# EAGLE design MTX_pic_piggyback_BRW_qfn_V14 (EAGLE 7.5.0)
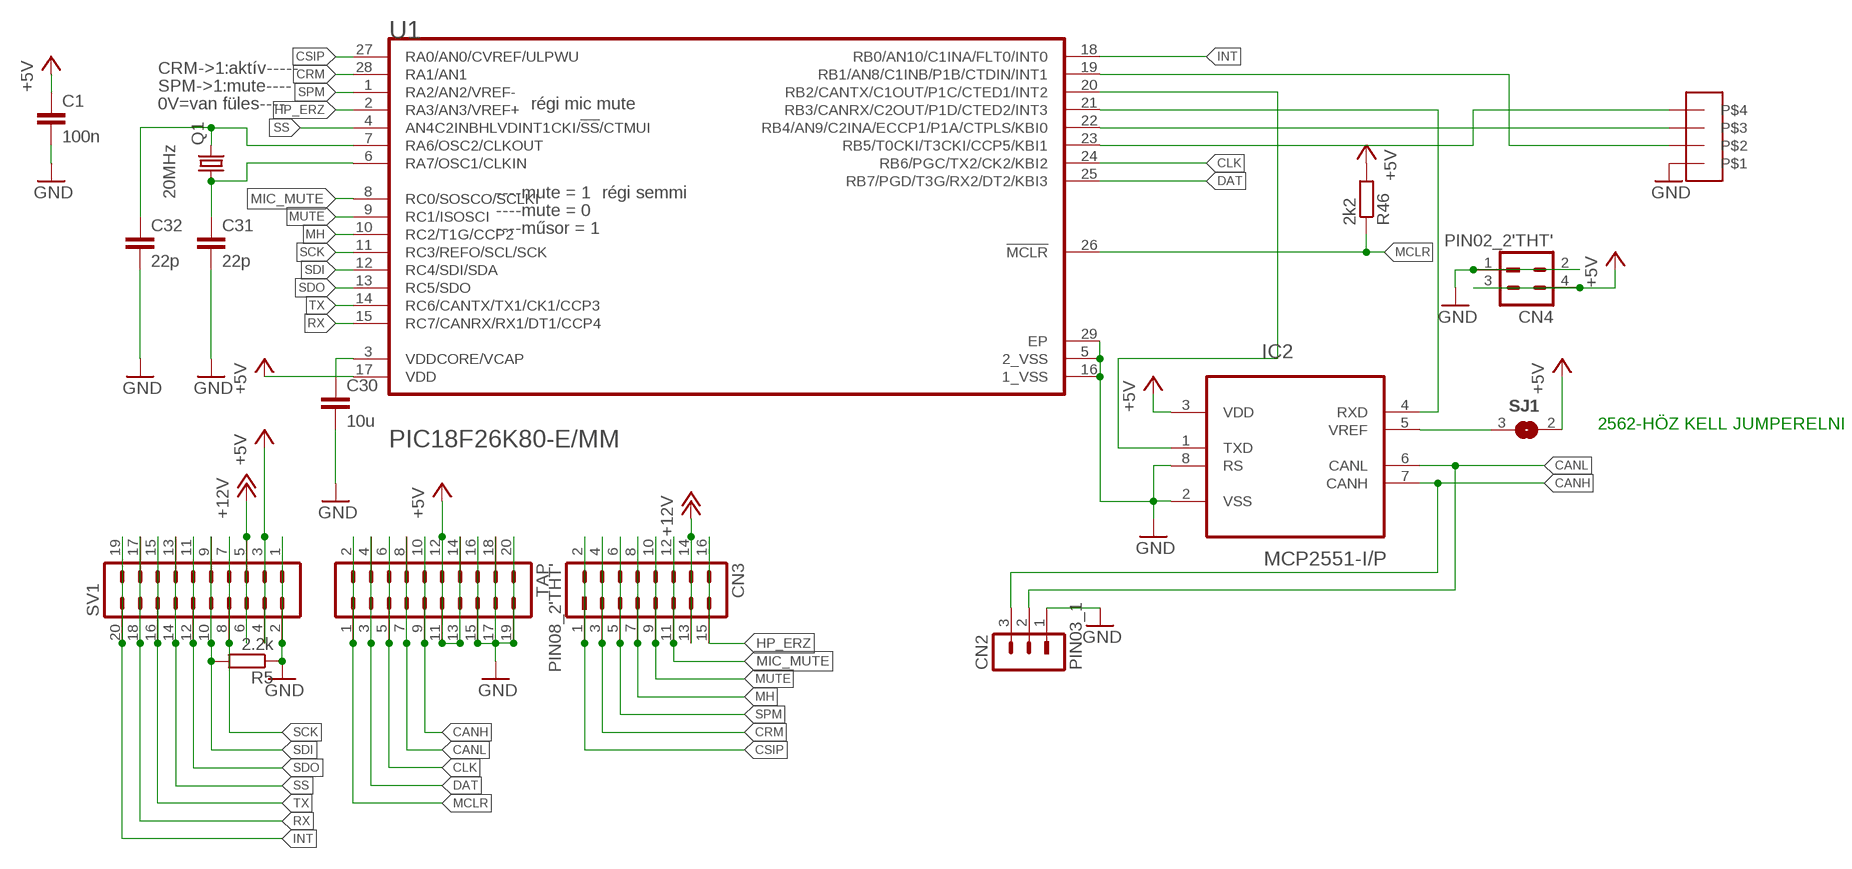
[diagram p0: schematic, sheet 1]

## Parts
C1  100n  C-EUC0805  [C0805]
C30  10u  C-EUC0805  [C0805]
C31  22p  C-EUC0805  [C0805]
C32  22p  C-EUC0805  [C0805]
CN2  PIN03_1  [PIN03_1]
CN3  PIN08_2'THT'  [PIN08_2]
CN4  PIN02_2'THT'  [PIN02_2]
IC2  MCP2551-I/P  [DIP254P762X432-8]
Q1  20MHz  XTAL_2QS  [XTAL_QS]
R5  2.2k  R-EU_R0805  [R0805]
R46  2k2  R-EU_R0805  [R0805]
SJ1  SJ  [SJ]
SV1  MA10-2  [MA10-2]
TAP  MA10-2  [MA10-2]
U1  MICROCHIP_PIC18F26K80-E-MMMICROCHIP_PIC18F26K80-E-MM_0_2  [MICROCHIP_PIC18F26K80-E-MM_2]
U$1  FEHER_TUS_4  [FEHER_TUS_4]

## Nets
+5V: C1.1 CN4.3 CN4.4 IC2.3(VDD) R46.2 SJ1.2 SV1.3 SV1.4 TAP.11 TAP.12 TAP.13 TAP.14 U1.17(VDD)
+12V: CN3.13 CN3.14 SV1.5 SV1.6
CANH: CN2.3 IC2.7(CANH) TAP.9 TAP.10
CANL: CN2.2 IC2.6(CANL) TAP.7 TAP.8
CLK: TAP.5 TAP.6 U1.24(RB6/PGC/TX2/CK2/KBI2)
CRM: CN3.3 CN3.4 U1.28(RA1/AN1)
CSIP: CN3.1 CN3.2 U1.27(RA0/AN0/CVREF/ULPWU)
DAT: TAP.3 TAP.4 U1.25(RB7/PGD/T3G/RX2/DT2/KBI3)
GND: C1.2 C30.2 C31.2 C32.2 CN2.1 CN4.1 CN4.2 IC2.2(VSS) IC2.8(RS) R5.1 SV1.1 SV1.2 TAP.15 TAP.16 TAP.17 TAP.18 TAP.19 TAP.20 U1.5(2_VSS) U1.16(1_VSS) U1.29(EP) U$1.P$1
HP_ERZ: CN3.15 CN3.16 U1.2(RA3/AN3/VREF+)
INT: SV1.19 SV1.20 U1.18(RB0/AN10/C1INA/FLT0/INT0)
MCLR: R46.1 TAP.1 TAP.2 U1.26(!MCLR!)
MH: CN3.7 CN3.8 U1.10(RC2/T1G/CCP2)
MIC_MUTE: CN3.11 CN3.12 U1.8(RC0/SOSCO/SCLKI)
MUTE: CN3.9 CN3.10 U1.9(RC1/ISOSCI)
N$1: IC2.1(TXD) U1.20(RB2/CANTX/C1OUT/P1C/CTED1/INT2)
N$2: IC2.5(VREF) SJ1.3
N$3: U1.23(RB5/T0CKI/T3CKI/CCP5/KBI1) U$1.P$4
N$4: U1.22(RB4/AN9/C2INA/ECCP1/P1A/CTPLS/KBI0) U$1.P$3
N$5: U1.19(RB1/AN8/C1INB/P1B/CTDIN/INT1) U$1.P$2
N$57: C30.1 U1.3(VDDCORE/VCAP)
N$58: C31.1 Q1.1 U1.6(RA7/OSC1/CLKIN)
N$59: C32.1 Q1.2 U1.7(RA6/OSC2/CLKOUT)
N$86: IC2.4(RXD) U1.21(RB3/CANRX/C2OUT/P1D/CTED2/INT3)
RX: SV1.17 SV1.18 U1.15(RC7/CANRX/RX1/DT1/CCP4)
SCK: SV1.7 SV1.8 U1.11(RC3/REFO/SCL/SCK)
SDI: R5.2 SV1.9 SV1.10 U1.12(RC4/SDI/SDA)
SDO: SV1.11 SV1.12 U1.13(RC5/SDO)
SPM: CN3.5 CN3.6 U1.1(RA2/AN2/VREF-)
SS: SV1.13 SV1.14 U1.4(AN4C2INBHLVDINT1CKI/!SS!/CTMUI)
TX: SV1.15 SV1.16 U1.14(RC6/CANTX/TX1/CK1/CCP3)

## Notes on the sheet
- CRM->1:aktív-----
- SPM->1:mute----
- 0V=van füles---- | régi mic mute
- ----mute = 1 | régi semmi
- ----mute = 0
- ----műsor = 1
- 2562-HÖZ KELL JUMPERELNI

## Library data of the parts
C1 C30-C32 = rcl:C-EU: CAPACITOR, European symbol
CN2 = Cf_Csatl:PIN03_1
CN3 = Cf_Csatl:PIN08_2
CN4 = Cf_Csatl:PIN02_2
IC2 = Microchip_By_element14_Batch_1:MCP2551-I/P: High-Speed CAN Transceiver; DESCRIPTION: CAN CTRL; MPN: MCP2551-I/P; OC_FARNELL: 1292240; OC_NEWARK: 61K2947; PACKAGE: PDIP-8; SUPPLIER: Microchip
Q1 = Cf_RLCPX:XTAL_2
R5 R46 = rcl:R-EU_: RESISTOR, European symbol
SJ1 = jumper:SJ: SMD solder JUMPER
SV1 TAP = con-lstb:MA10-2: PIN HEADER; OC_FARNELL: unknown; OC_NEWARK: unknown
U1 = MM:MICROCHIP_PIC18F26K80-E-MM: MCHP-PIC18F26K80-QFN-S-28; CIIVA_IDS: 1212760; COMPONENT_LINK_2_DESCRIPTION: Package Specification; COMPONENT_LINK_2_URL: http://www.microchip.com/stellent/groups/techpub_sg/documents/packagingspec/en012702.pdf; COMPONENT_LINK_3_DESCRIPTION: URL Link1; COMPONENT_LINK_3_URL: Product URL:http://www.microchip.com/datasheet/PIC18F26K80; DATASHEET: http://ww1.microchip.com/downloads/en/DeviceDoc/39977f.pdf; DATASHEET_VERSION: Rev. F; DIGITAL_COMMUNICATION: 2 -A/E/USART, 0 -SPI, 1 -MSSP(SPI/I2C); EEPROM_DATA_MEMORY_BYTES: 1024; FOOTPRINT_VARIANT_NAME_0: Level C; FOOTPRINT_VARIANT_NAME_1: Level B; FOOTPRINT_VARIANT_NAME_2: Level A; IMPORTED: yes; IMPORTED_FROM: vault; IMPORT_TS: 1521866653; INTERNAL_OSCILLATOR: 16 MHz, 31 kHz; IO_PINS: 24; MAX_CPU_SPEED_MHZ: 64; MEMORY_TYPE: Flash; MF: Microchip; MOUNTING_TECHNOLOGY: Surface Mount; MPN: PIC18F26K80-E/MM; OF_AD_CHANNELS: 8; OPERATION_VOLTAGE_RANGE: 1.8V - 5.5V; PACKAGE: QFN-MM28; PACKAGE_DESCRIPTION: 28-Lead Plastic Quad Flat, 6 x 6 mm Body, 0.65 mm Pitch; PACKAGE_VERSION: C04-124C, 12/2012; PACKING: TUBE; PIN_0_0_10_INSIDE_EDGE: clock; PIN_0_0_13_INSIDE_EDGE: clock; PIN_0_0_22_INSIDE_EDGE: clock; PIN_0_0_23_INSIDE_EDGE: clock; PIN_0_0_3_INSIDE_EDGE: clock; PIN_0_0_5_INSIDE_EDGE: clock; PIN_0_0_7_INSIDE_EDGE: clock; PREFIX: U; PROGRAM_MEMORY_KBYTES: 64; PROGRAM_MEMORY_KWORDS: 32; RAM: 3648; RELEASE_DATE: 1370053162; ROHS: Yes; TIMERS: 2 - 8-bit, 3 - 16-bit, 0 - 32-bit; VAULT_GUID: 47AB0A35-EEAF-4F82-94BF-3D4E1634C10F; VAULT_REVISION: 6BE9EE8F-3B69-4AFC-920E-139E03155BFE
U$1 = csatik:FEHER_TUS_4

## Board
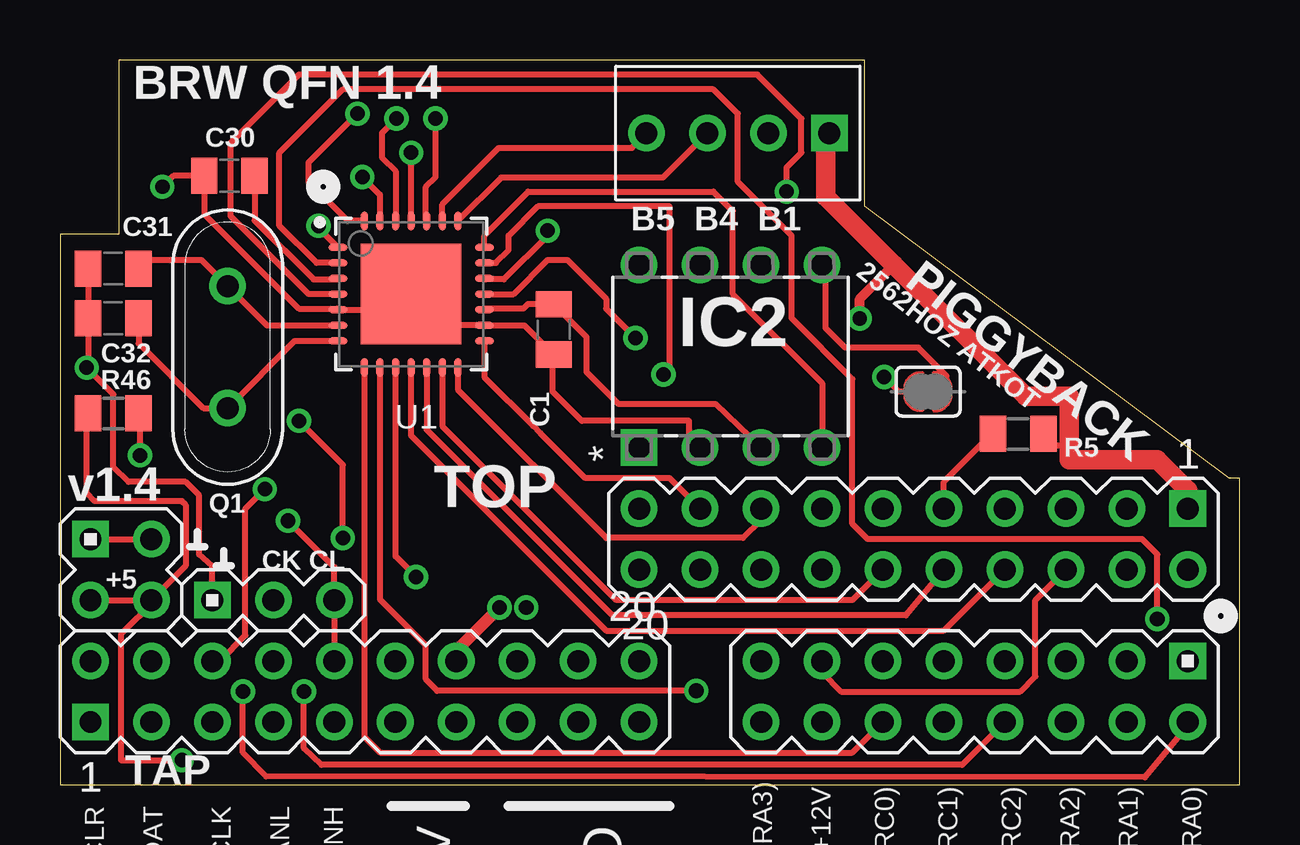
[diagram p1: board, top side]
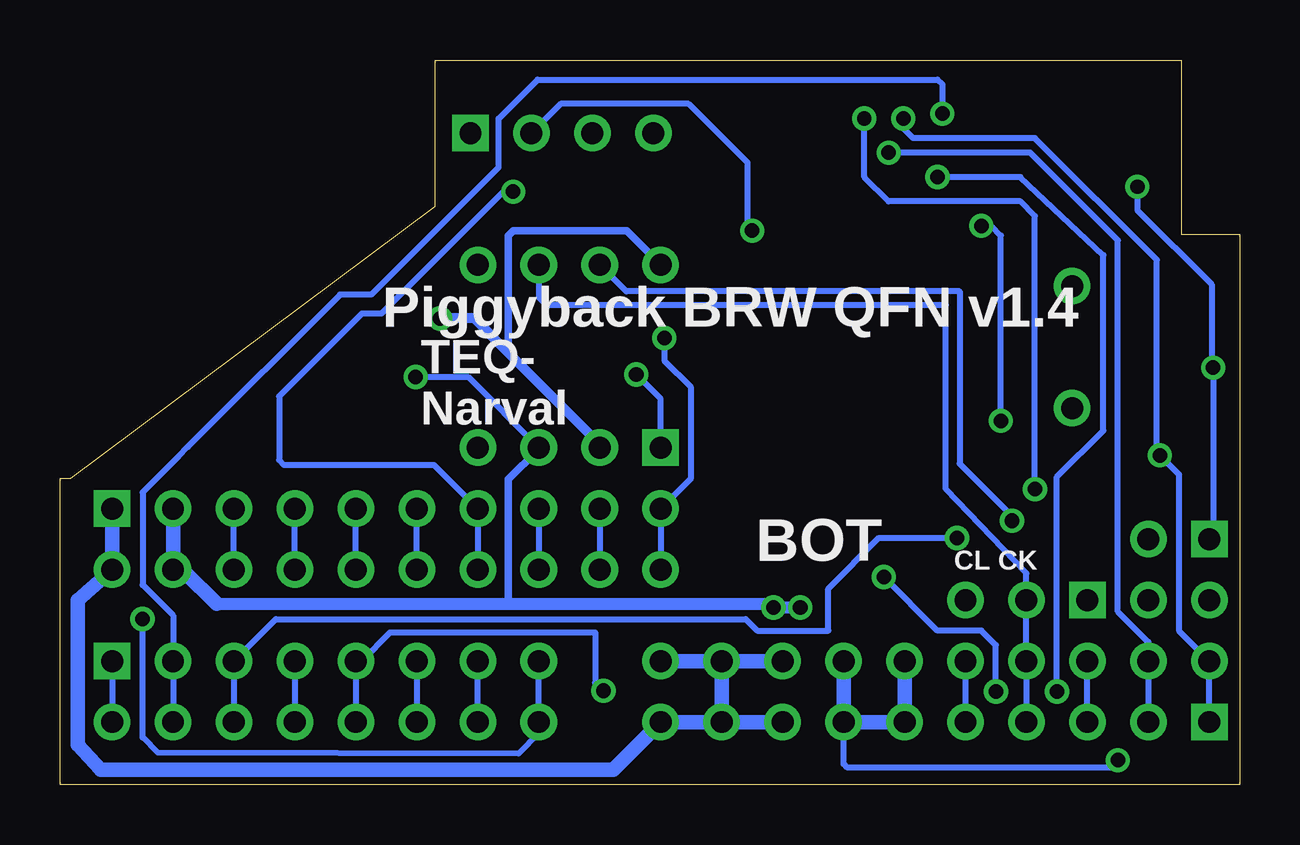
[diagram p2: board, bottom side, seen from below]

Size 49.16 x 30.2 mm. Coordinates in mm from the lower left corner, seen from the top.
Outline: 0,0 49.16,0 49.16,12.78 48.71,12.78 33.53,24.11 33.53,30.2 2.44,30.2 2.44,22.94 0,22.94 0,0
Copper layers (1*16): Top 0.035mm / dielectric 1.5mm / Bottom 0.035mm
Design rules "default": minimum track width 10mil, minimum drill 24mil, track to track 10mil, track to pad 10mil, pad to pad 10mil, via to via 10mil, smd to smd 10mil, copper to edge 10mil, drill to drill 10mil, minimum pad ring 10mil, minimum via ring 8mil, stop-mask expansion 4mil, vias tented up to drill 0mil, thermal gap 10mil

### Footprints (pad centres in the part's own frame; a part is rotated, then mirrored left to right if it is on the bottom)
C0805 = smd 1.1 x 1.5: 1 -1.05,0; 2 1.05,0
PIN03_1 = drill 0.914 pad 1.524 square: 1 -2.54,0 | drill 0.914 pad 1.524: 2 0,0; 3 2.54,0
PIN08_2 = drill 0.914 pad 1.524 square: 1 -7.62,0 | drill 0.914 pad 1.524: 2 -7.62,2.54; 3 -5.08,0; 4 -5.08,2.54; 5 -2.54,0; 6 -2.54,2.54; 7 0,0; 8 0,2.54; 9 2.54,0; 10 2.54,2.54; 11 5.08,0; 12 5.08,2.54; 13 7.62,0; 14 7.62,2.54; 15 10.16,0; 16 10.16,2.54
PIN02_2 = drill 0.914 pad 1.524 square: 1 0,0 | drill 0.914 pad 1.524: 2 0,2.54; 3 2.54,0; 4 2.54,2.54
DIP254P762X432-8 = drill 0.914 pad 1.524 square: 1 -3.81,3.81 | drill 0.914 pad 1.524: 2 -3.81,1.27; 3 -3.81,-1.27; 4 -3.81,-3.81; 5 3.81,-3.81; 6 3.81,-1.27; 7 3.81,1.27; 8 3.81,3.81
XTAL_QS = drill 0.914 pad 1.524: 1 -2.54,0; 2 2.54,0
R0805 = smd 1.1 x 1.5: 1 -1.05,0; 2 1.05,0
SJ = smd 0.508 x 0.508: 1 -0.762,0; 2 0.762,0; 3 -0.762,0; 4 0.762,0
MA10-2 = drill 0.914 pad 1.524 square: 1 -11.43,-1.27 | drill 0.914 pad 1.524: 2 -11.43,1.27; 3 -8.89,-1.27; 4 -8.89,1.27; 5 -6.35,-1.27; 6 -6.35,1.27; 7 -3.81,-1.27; 8 -3.81,1.27; 9 -1.27,-1.27; 10 -1.27,1.27; 11 1.27,-1.27; 12 1.27,1.27; 13 3.81,-1.27; 14 3.81,1.27; 15 6.35,-1.27; 16 6.35,1.27; 17 8.89,-1.27; 18 8.89,1.27; 19 11.43,-1.27; 20 11.43,1.27
MICROCHIP_PIC18F26K80-E-MM_2 = smd 0.8 x 0.3: 1 -3.05,1.95; 2 -3.05,1.3; 3 -3.05,0.65; 4 -3.05,0; 5 -3.05,-0.65; 6 -3.05,-1.3; 7 -3.05,-1.95; 15 3.05,-1.95; 16 3.05,-1.3; 17 3.05,-0.65; 18 3.05,0; 19 3.05,0.65; 20 3.05,1.3; 21 3.05,1.95 | smd 0.3 x 0.8: 8 -1.95,-3.05; 9 -1.3,-3.05; 10 -0.65,-3.05; 11 0,-3.05; 12 0.65,-3.05; 13 1.3,-3.05; 14 1.95,-3.05; 22 1.95,3.05; 23 1.3,3.05; 24 0.65,3.05; 25 0,3.05; 26 -0.65,3.05; 27 -1.3,3.05; 28 -1.95,3.05 | smd 4.18 x 4.18: 29 0,0
FEHER_TUS_4 = drill 0.914 pad 1.524 square: P$1 3.81,0 | drill 0.914 pad 1.524: P$2 1.27,0; P$3 -1.27,0; P$4 -3.81,0

### Placement (x,y rotation side)
C1  20.57,18.98 270 top
C30  7.06,25.38 180 top
C31  2.22,21.51 180 top
C32  2.22,19.45 180 top
CN2  8.89,7.7 0 top
CN3  39.37,5.16 180 top
CN4  1.27,10.24 270 top
IC2  27.94,17.86 90 top
Q1  6.99,18.24 270 top
R5  39.92,14.62 180 top
R46  2.22,15.48 180 top
SJ1  36.17,16.39 180 top
SV1  35.56,10.24 180 top
TAP  12.7,3.89 0 top
U1  14.63,20.45 0 top
U$1  28.24,27.16 0 top

### Tracks (layer width: path | path; a pad name or v marks a point on that pad's centre or on a via)
+5V  (via drill 0.6, 0.61)
  Top 0.254: IC2.3 27.3,15.88 23.27,15.88 21.95,17.2 21.95,18.66 C1.1 19.49,20.03 19.3,19.84 17.72,19.84 U1.17 | CN4.3 CN4.4 | CN4.4 3.97,7.7 2.54,6.27 2.54,1.03 v5.08,1.03 | 1.17,15.42 R46.2 1.11,15.42 1.11,12.14 1.43,11.83 5.08,11.83 5.24,11.67 5.24,9.13 CN4.4 | SJ1.2 34.95,16.39 v34.34,17
  Top 0.508: TAP.14 16.51,5.58 v18.32,7.39
  Bottom 0.254: TAP.13 16.51,0.87 16.35,0.71 5.4,0.71 v5.08,1.03 | v34.34,17 32.16,17 IC2.3
  Bottom 0.305: 30.68,7.54 30.48,7.74 30.48,12.73 29.26,13.95 29.26,14 IC2.3
  Bottom 0.508: 42.62,7.54 30.68,7.54 19.58,7.54 v19.43,7.39 v18.32,7.39
  Bottom 0.61: SV1.3 SV1.4 43.97,8.89 42.62,7.54 | TAP.14 TAP.13 TAP.11 TAP.12
+12V
  Top 0.254: SV1.6 40.72,7.78 40.64,7.7 40.64,4.52 40.01,3.89 32.54,3.89 31.75,4.68 CN3.13
  Bottom 0.254: SV1.6 SV1.5 | CN3.14 CN3.13
CANH  (via drill 0.61 pad 1.02)
  Top 0.254: TAP.10 CN2.3 11.43,9.08 v9.5,11.01
  Bottom 0.254: IC2.7 25.56,20.56 11.67,20.56 11.67,13.38 10.99,12.71 10.64,12.35 9.5,11.21 v9.5,11.01 | TAP.10 TAP.9
CANL
  Bottom 0.254: TAP.7 TAP.8 CN2.2 8.89,7.85 8.89,8.81 12.24,12.32 12.24,20 28.89,20 29.21,20.32 IC2.6
CLK  (via drill 0.6)
  Top 0.254: TAP.6 6.66,5.16 7.72,6.23 7.72,11.51 v8.53,12.32 | U1.24 15.24,23.54 15.24,24.92 15.65,25.33 v15.65,27.77
  Bottom 0.254: TAP.5 TAP.6 | v8.53,12.32 8.53,23.7 9.14,24.31 14.63,24.31 15.65,25.33 v15.65,27.77
CRM  (via drill 0.6)
  Top 0.254: U1.28 11.99,23.5 10.36,25.12 10.36,25.94 v12.39,27.97
  Bottom 0.254: CN3.4 CN3.3 44.45,7.06 45.72,8.33 45.72,12.19 44.23,13.68 43.83,14.08 37.48,20.42 36.2,20.42 30.89,25.73 30.89,27.77 29.26,29.39 12.6,29.39 12.39,29.19 v12.39,27.97
CSIP  (via drill 0.6, 0.61 pad 1.02)
  Top 0.254: v7.62,3.89 7.62,1.35 8.58,0.36 45.2,0.32 46.99,2.46 CN3.2 | v12.6,25.33 13.33,24.6 U1.27
  Bottom 0.254: CN3.1 CN3.2 | v7.62,3.89 7.62,12.83 5.69,14.76 5.69,22.08 9.14,25.33 v12.6,25.33
DAT  (via drill 0.6)
  Top 0.254: U1.25 v14.63,26.34
  Bottom 0.254: TAP.3 TAP.4 3.81,5.95 5.08,7.22 5.08,22.69 8.74,26.34 v14.63,26.34
GND  (via drill 0.6)
  Top 0.254: C31.2 C32.2 1.17,17.44 v1.11,17.38 2.22,16.27 2.22,13.26 2.86,12.62 5.24,12.62 5.79,12.07 5.79,9.6 6.35,9.13 CN2.1 | CN4.2 CN4.1 1.17,10.34 | SV1.1 46.99,11.87 | IC2.2 26.21,14.51 26.21,15.17 21.74,15.17 20.52,16.39 20.52,17.88 C1.2 19.35,19.15 U1.16 15.93,19.15 arc-90 U1.29 arc-90 13.98,19.8 U1.5 11.54,19.84 9.96,19.84 6.01,23.79 C30.2 4.72,25.38 v4.27,24.92 | R5.1 41.44,14.15 42.06,14.15
  Top 0.406: SV1.1 46.94,11.51 | v33.33,19.43 33.33,20.25 34.75,21.67
  Top 0.813: U$1.P$1 31.9,27 31.9,24.51 34.75,21.67 40.23,16.18 42.06,16.18 42.06,14.15 42.06,13.54 45.72,13.54 46.99,12.27 SV1.1
  Bottom 0.254: CN4.1 1.11,10.4 v1.11,17.38 1.17,17.44 1.17,20.86 4.27,23.95 v4.27,24.92 | 26.62,14.15 26.62,14.1 IC2.2
  Bottom 0.305: IC2.8 25.55,23.09 30.28,23.09 30.48,22.89 30.48,18.01
  Bottom 0.406: 26.62,14.15 30.48,18.01 31.9,19.43 v33.33,19.43
  Bottom 0.61: TAP.17 20.93,2.62 TAP.15 | TAP.18 TAP.17 | TAP.18 TAP.20 | TAP.16 TAP.18 | SV1.1 SV1.2 48.42,7.7 48.42,1.67 47.47,0.64 26.11,0.64 TAP.19 TAP.17
HP_ERZ  (via drill 0.61 pad 1.02)
  Top 0.254: v45.72,6.91 45.72,9.6 45.09,10.24 33.66,10.24 33.02,10.87 33.02,16.91 30.48,19.45 30.48,22.89 28.25,25.12 28.25,27.97 27.23,28.98 11.79,28.98 9.14,26.34 9.14,23.3 10.69,21.75 U1.2
  Bottom 0.254: v45.72,6.91 45.72,1.98 45.09,1.35 30.05,1.31 29.21,2.14 CN3.16 CN3.15
INT  (via drill 0.6)
  Top 0.254: U1.18 18.9,20.45 20.32,21.87 21.13,21.87 22.76,20.25 22.76,19.84 v23.98,18.62
  Bottom 0.254: SV1.20 SV1.19 22.86,12.78 22.86,16.56 23.98,17.68 v23.98,18.62
MCLR  (via drill 0.6)
  Top 0.254: R46.1 3.33,15.42 v3.33,13.73 3.49,13.89 | v14.02,27.77 13.41,27.16 13.41,26.14 13.98,25.57 U1.26
  Bottom 0.254: TAP.1 TAP.2 2.54,6.43 2.54,12.94 v3.33,13.73 3.45,13.73 3.45,21.87 8.53,26.95 13.61,26.95 14.02,27.36 v14.02,27.77
MH  (via drill 0.6, 0.61 pad 1.02)
  Top 0.254: v10.16,3.89 10.16,1.52 10.89,0.83 37.58,0.83 CN3.8 | U1.10 13.98,9.52 v14.83,8.66
  Bottom 0.254: CN3.7 CN3.8 | v10.16,3.89 10.16,5.82 10.77,6.43 12.6,6.43 v14.83,8.66
MIC_MUTE
  Top 0.254: CN3.12 33.02,1.35 13.34,1.35 12.97,1.72 12.7,1.98 12.68,2 U1.8
  Bottom 0.254: CN3.11 CN3.12
MUTE  (via drill 0.61 pad 1.02)
  Top 0.254: v26.51,3.92 15.72,3.92 15.24,4.4 15.24,5.82 13.33,7.73 U1.9
  Bottom 0.254: CN3.10 CN3.9 36.59,5.16 35.4,6.35 26.86,6.35 26.86,4.27 v26.51,3.92
N$1  (via drill 0.61 pad 1.02)
  Top 0.254: v25.15,17.1 25.4,17.35 25.4,24.11 19.91,24.11 18.69,22.89 18.69,22.28 18.17,21.75 U1.20
  Bottom 0.254: IC2.1 24.13,16.08 v25.15,17.1
N$2
  Top 0.254: SJ1.3 36.93,17.05 35.76,18.22 32.72,18.22 31.9,19.03 31.9,21.52 IC2.5
N$3
  Top 0.254: U$1.P$4 23.82,26.55 18.29,26.55 15.93,24.19 U1.23
N$4
  Top 0.254: U$1.P$3 25.12,25.3 18.38,25.3 U1.22
N$5  (via drill 0.6)
  Top 0.254: v20.32,23.09 20.32,22.89 18.49,21.06 17.72,21.06 U1.19
  Bottom 0.254: U$1.P$2 28.3,28.38 22.96,28.38 20.52,25.94 20.52,23.3 v20.32,23.09
N$57
  Top 0.254: C30.1 8.11,23.52 10.57,21.06 11.54,21.06 U1.3
N$58
  Top 0.254: C31.1 3.63,21.87 5.89,21.87 Q1.1 8.62,19.15 U1.6
N$59
  Top 0.254: C32.1 3.27,18.4 5.97,15.7 Q1.2 9.79,18.5 U1.7
N$86
  Top 0.254: IC2.4 31.75,16.74 28.04,20.45 28.04,23.9 27.23,24.72 19.51,24.72 17.68,22.89 U1.21
RX
  Top 0.254: SV1.17 25.4,12.78 21.89,12.78 20.02,14.66 19.71,14.96 17.68,16.99 U1.15
  Bottom 0.254: SV1.17 SV1.18
SCK
  Top 0.254: SV1.8 36.83,6.43 22.76,6.43 14.63,14.56 U1.11
  Bottom 0.254: SV1.8 SV1.7
SDI
  Top 0.254: SV1.10 35.24,7.06 23.02,7.06 19.45,10.64 19.1,10.98 15.28,14.8 U1.12 | SV1.9 36.83,12.62 38.83,14.62 R5.2
  Bottom 0.254: SV1.10 SV1.9
SDO
  Top 0.254: SV1.12 33.02,7.7 23.18,7.7 15.93,14.95 U1.13
  Bottom 0.254: SV1.12 SV1.11
SPM  (via drill 0.6)
  Top 0.254: v11.79,10.29 11.79,13.34 v9.96,15.17 | v10.77,23.3 10.77,23.21 U1.1
  Bottom 0.254: CN3.6 CN3.5 40.16,6.91 20.59,6.91 20.12,6.43 17.14,6.43 17.14,8.18 15.04,10.29 v11.79,10.29 | v9.96,15.17 9.96,22.89 10.36,23.3 v10.77,23.3
SS  (via drill 0.6)
  Top 0.254: U1.4 10.36,20.45 7.11,23.7 7.11,26.75 9.96,29.59 29.06,29.59 30.89,27.77 30.89,26.34 30.28,25.73 v30.28,24.72
  Bottom 0.254: SV1.14 SV1.13 33.58,13.34 39.83,13.34 40.03,13.54 40.03,16.18 36.58,19.64 35.76,19.64 30.68,24.72 v30.28,24.72
TX
  Top 0.254: SV1.15 29.21,11.05 28.45,10.29 22.76,10.29 16.58,16.47 U1.14
  Bottom 0.254: SV1.15 SV1.16

### Text on the board
tNames: BRW QFN 1.4 | B5 | B4 | B1 | 2562HOZ ATKOT | PIGGYBACK | v1.4 | TOP | CK CL | +5 | HPERZ(RA3) | +12V | MICMUTE(RC0) | MUTE(RC1) | MH(RC2) | SPM(RA2) | CRM(RA1) | CSIP(RA0) | MCLR | DAT | CLK | CANL | CANH | +5V | GND
bNames: Piggyback BRW QFN v1.4 | TEQ- / Narval | CL CK | BOT
tTest: RX | TX | SS | SDO | SDI | CLK | 12V | 5V | INT